# EAGLE schematic bathroom-monitor-rev (EAGLE 7.5.0)
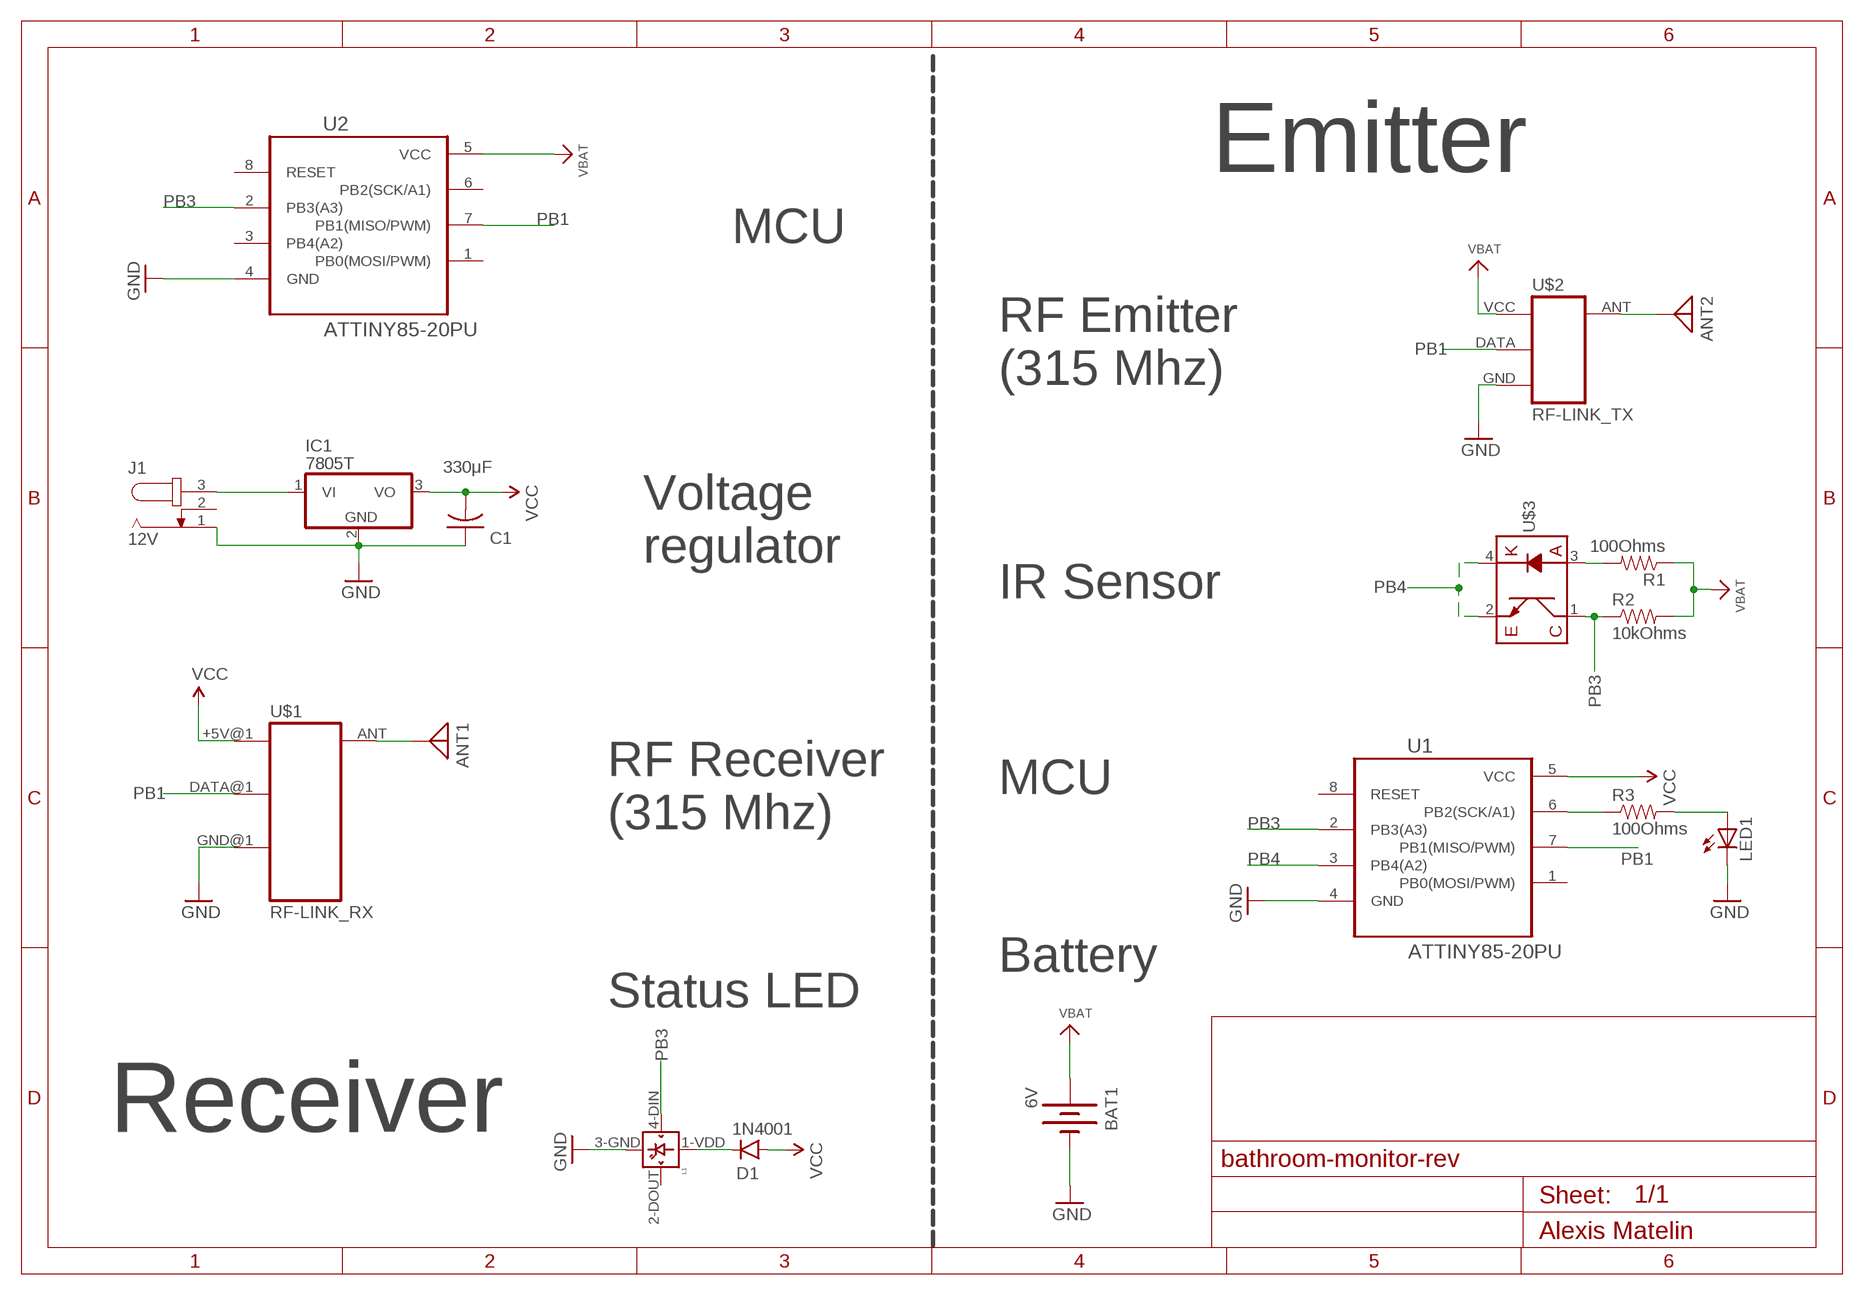
[diagram p0: schematic, sheet 1]

## Parts
ANT1  ANTENNA  [PAD-01]
ANT2  ANTENNA  [PAD-01]
BAT1  6V  BATTERYAAA  [BATTERY-AAA]
C1  330μF  C-US025-025X050  [C025-025X050]
D1  1N4001  DIODEKIT2  [DIODE-1N4001-KIT]
IC1  7805T  [TO220H]
J1  12V  JACK-PLUG1  [SPC4078]
L1  WS2812B  [WS2812B]
LED1  LED3MM  [LED3MM]
R1  100Ohms  RESISTORPTH-1/2W  [AXIAL-0.5]
R2  10kOhms  RESISTORPTH-1/2W  [AXIAL-0.5]
R3  100Ohms  RESISTORPTH-1/2W  [AXIAL-0.5]
U1  ATTINY85-20PU  [DIP254P762X533-8]
U2  ATTINY85-20PU  [DIP254P762X533-8]
U$1  RF-LINK_RX  [RF-LINK_RX]
U$2  RF-LINK_TX  [RF-LINK_TX]
U$3  QRD1114  [QRD1114]

## Nets
GND: BAT1.GND@1(-) C1.1 IC1.2(GND) J1.1 L1.3-GND(GND) LED1.K(C) U1.4(GND) U2.4(GND) U$1.GND@1(GND) U$2.GND
N$1: IC1.1(VI) J1.3
N$2: ANT1.1 U$1.ANT
N$3: ANT2.1 U$2.ANT
N$4: R1.P$2 U$3.3(A)
N$5: R3.P$1 U1.6(PB2(SCK/A1))
N$6: D1.C L1.1-VDD(VDD)
N$7: LED1.A R3.P$2
PB1: U1.7(PB1(MISO/PWM)) U2.7(PB1(MISO/PWM)) U$1.DATA@1(DATA) U$2.DATA
PB3: L1.4-DIN(DIN) R2.P$1 U1.2(PB3(A3)) U2.2(PB3(A3)) U$3.1(E)
PB4: U1.3(PB4(A2)) U$3.2(C) U$3.4(K)
VBAT: BAT1.PWR@1(+) R1.P$1 R2.P$2 U2.5(VCC) U$2.VCC(+5V)
VCC: C1.2 D1.A IC1.3(VO) U1.5(VCC) U$1.+5V@1(+5V)
Unconnected: J1.2 L1.2-DOUT(DOUT) U1.1(PB0(MOSI/PWM)) U2.1(PB0(MOSI/PWM)) U2.3(PB4(A2)) U2.6(PB2(SCK/A1))

## Notes on the sheet
- Emitter
- MCU
- RF Emitter
  (315 Mhz)
- Voltage 
  regulator
- IR Sensor
- MCU
- RF Receiver 
  (315 Mhz)
- Battery
- Status LED
- Receiver

## Power pins joined to a net without a drawn wire
RESET: U1.8(RESET) U2.8(RESET)

## Library data of the parts
ANT1 ANT2 = discrete:ANTENNA: Antenna
BAT1 = SparkFun-Electromechanical:BATTERY: Battery Holders Various common sizes : AA, AAA, 18650 (PRT-12895), 20mm coin cell and 12mm coin cell. 20MM_4LEGS, BATT-10373; PROD_ID: BATT-08571
C1 = adafruit:C-US: CAPACITOR, American symbol
D1 = SparkFun-DiscreteSemi:DIODE: Diode These are standard reverse protection diodes and small signal diodes. SMA package can handle up to about 1A. SOD-323 can handle about 200mA. What the SOD-323 package when ordering, there are some mfgs out there that are 5-pin packages.
IC1 = adafruit:78*: Positive VOLTAGE REGULATOR Added bigger pads to the TO-92 package
J1 = con-jack:JACK-PLUG: DC POWER JACK Power Jack, DC, Right Angle, Through Hole, Rated 5A at 16VDC, PC Terminals Distributor: Farnell (www.Farnell.de) Drawing: 84N1161.pdf / 84N1162.pdf Manufacturer: SPC Technology (www.spctechnology.com) Type: SPC4077 / SPC 4078; OC_FARNELL: unknown; OC_NEWARK: unknown
L1 = adafruit:WS2812B
LED1 = adafruit:LED: LED OSRAM: - CHIPLED LG R971, LG N971, LY N971, LG Q971, LY Q971, LO R971, LY R971 LH N974, LH R974 LS Q976, LO Q976, LY Q976 LO Q996 - Hyper CHIPLED LW Q18S LB Q993, LB Q99A, LB R99A - SideLED LS A670, LO A670, LY A670, LG A670, LP A670 LB A673, LV A673, LT A673, LW A673 LH A674 LY A675 LS A676, LA A676, LO A676, LY A676, LW A676 LS A679, LY A679, LG A679 - Hyper Micro SIDELED® LS Y876, LA Y876, LO Y876, LY Y876 LT Y87S - SmartLED LW L88C, LW L88S LB L89C, LB L89S, LG L890 LS L89K, LO L89K, LY L89K LS L896, LA L896, LO L896, LY L896 - TOPLED LS T670, LO T670, LY T670, LG T670, LP T670 LSG T670, LSP T670, LSY T670, LOP T670, LYG T670 LG T671, LOG T671, LSG T671 LB T673, LV T673, LT T673, LW T673 LH T674 LS T676, LA T676, LO T676, LY T676, LB T676, LH T676, LSB T676, LW T676 LB T67C, LV T67C, LT T67C, LS T67K, LO T67K, LY T67K, LW E67C LS E67B, LA E67B, LO E67B, LY E67B, LB E67C, LV E67C, LT E67C LW T67C LS T679, LY T679, LG T679 LS T770, LO T770, LY T770, LG T770, LP T770 LB T773, LV T773, LT T773, LW T773 LH T774 LS E675, LA E675, LY E675, LS T675 LS T776, LA T776, LO T776, LY T776, LB T776 LHGB T686 LT T68C, LB T68C - Hyper Mini TOPLED® LB M676 - Mini TOPLED Santana® LG M470 LS M47K, LO M47K, LY M47K Source: http://www.osram.convergy.de/
R1-R3 = SparkFun-Resistors:RESISTOR: Resistor Basic schematic elements and footprints for 0603, 1206, and PTH resistors.
U1 U2 = Atmel_By_element14_Batch_1-00:ATTINY85-20PU: 8-bit Microcontroller with In-System Programmable Flash; MPN: ATTINY85-20PU; OC_FARNELL: 1455162; OC_NEWARK: 58M3796; PACKAGE: PDIP-8; SUPPLIER: Atmel
U$1 = SparkFun-RF:RF-LINK_RX: RF Link receivers- WRL-8947, 8948, 8949, 8950, 10532, 10533
U$2 = SparkFun-RF:RF-LINK_TX: RF Link transmitters WRL-8945, 8946
U$3 = SparkFun-Sensors:QRD1114: Reflective object sensor